# Altium schematic sheet Motor Drive Board Header.SchDoc
size A4; SheetNumber: 3; SheetTotal: 3
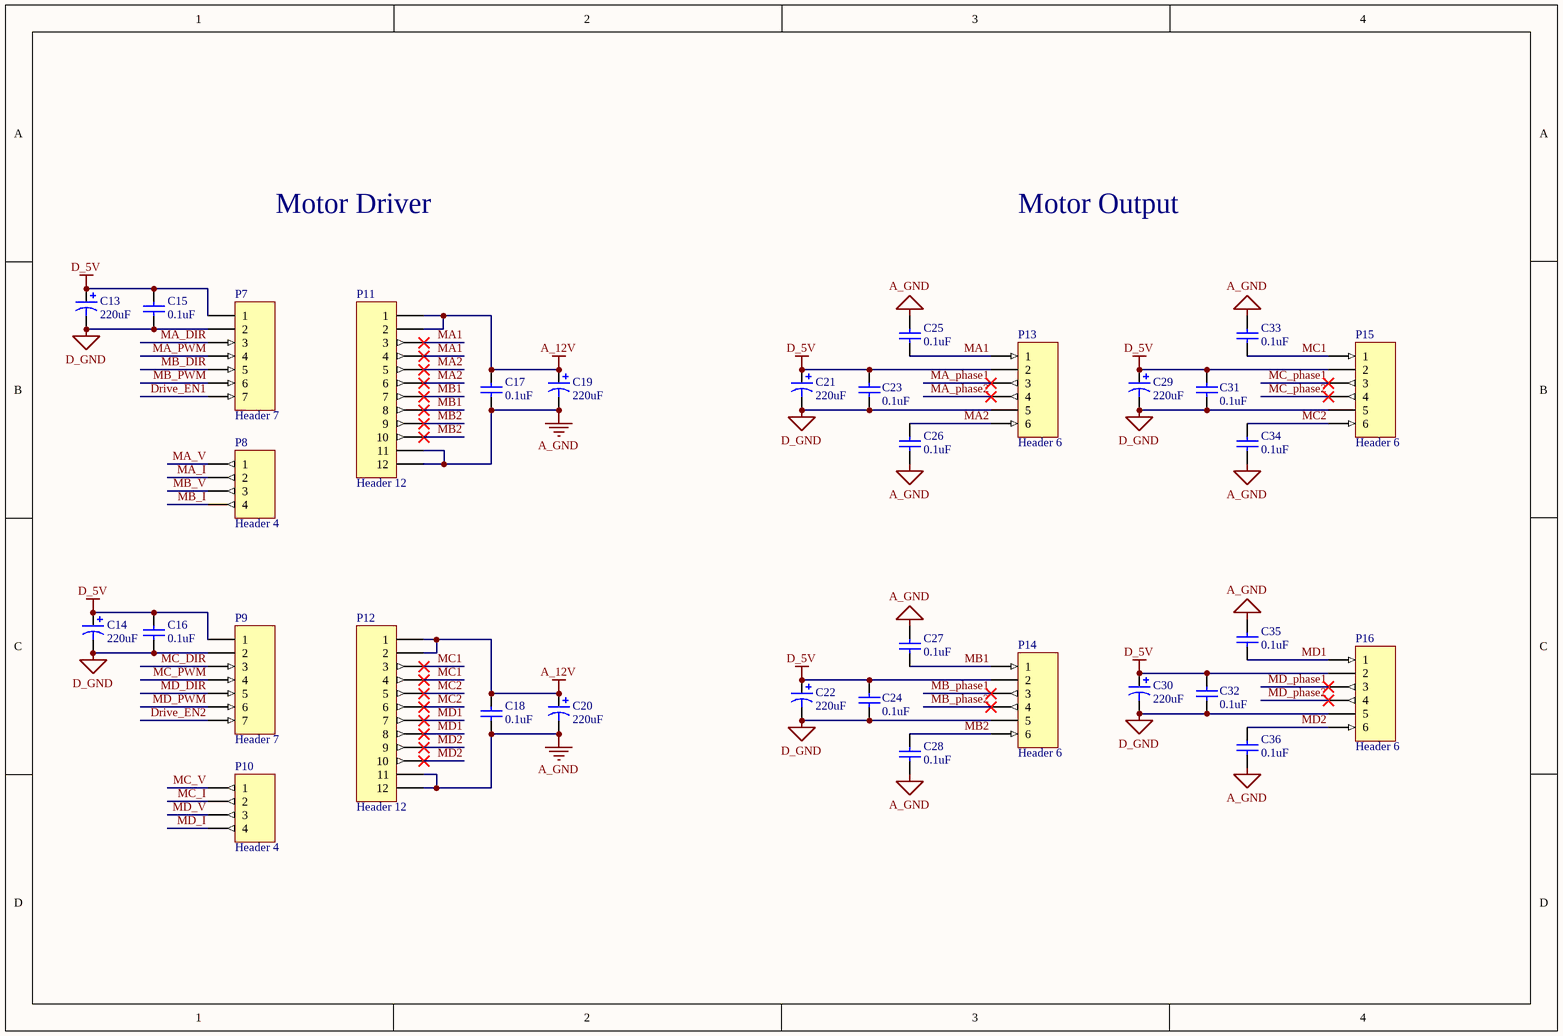
[diagram p0: Motor Drive Board Header.SchDoc]

## Parts
C13  220uF  [VZT221M1ETR-0607]
C14  220uF  [VZT221M1ETR-0607]
C15  0.1uF  [1210B104K500NT]
C16  0.1uF  [1210B104K500NT]
C17  0.1uF  [1210B104K500NT]
C18  0.1uF  [1210B104K500NT]
C19  220uF  [VZT221M1ETR-0607]
C20  220uF  [VZT221M1ETR-0607]
C21  220uF  [VZT221M1ETR-0607]
C22  220uF  [VZT221M1ETR-0607]
C23  0.1uF  [CL10B104KA8NNNC]
C24  0.1uF  [CL10B104KA8NNNC]
C25  0.1uF  [1210B104K500NT]
C26  0.1uF  [1210B104K500NT]
C27  0.1uF  [1210B104K500NT]
C28  0.1uF  [1210B104K500NT]
C29  220uF  [VZT221M1ETR-0607]
C30  220uF  [VZT221M1ETR-0607]
C31  0.1uF  [CL10B104KA8NNNC]
C32  0.1uF  [CL10B104KA8NNNC]
C33  0.1uF  [1210B104K500NT]
C34  0.1uF  [1210B104K500NT]
C35  0.1uF  [1210B104K500NT]
C36  0.1uF  [1210B104K500NT]
P7  Header 7  [KH-2.54FH-1X7P-H8.5]
P8  Header 4  [KH-2.54FH-1X4P-H8.5]
P9  Header 7  [KH-2.54FH-1X7P-H8.5]
P10  Header 4  [KH-2.54FH-1X4P-H8.5]
P11  Header 12  [KH-2.54FH-1X12P-H8.5 (Pad Linked)]
P12  Header 12  [KH-2.54FH-1X12P-H8.5 (Pad Linked)]
P13  Header 6  [B6B-XH-A(LF)(SN)]
P14  Header 6  [B6B-XH-A(LF)(SN)]
P15  Header 6  [B6B-XH-A(LF)(SN)]
P16  Header 6  [B6B-XH-A(LF)(SN)]

## Nets
A_12V: C17.2 C18.2 C19.1 C20.1 P11.1 P11.2 P12.1 P12.2
A_GND: C17.1 C18.1 C19.2 C20.2 C25.2 C26.1 C27.2 C28.1 C33.2 C34.1 C35.2 C36.1 P11.11 P11.12 P12.11 P12.12
D_5V: C13.1 C14.1 C15.2 C16.2 C21.1 C22.1 C23.2 C24.2 C29.1 C30.1 C31.2 C32.2 P7.1 P9.1 P13.2 P14.2 P15.2 P16.2
D_GND: C13.2 C14.2 C15.1 C16.1 C21.2 C22.2 C23.1 C24.1 C29.2 C30.2 C31.1 C32.1 P7.2 P9.2 P13.5 P14.5 P15.5 P16.5
Drive_EN1: P7.7
Drive_EN2: P9.7
MA1: C25.1 P11.3 P11.4 P13.1
MA2: C26.2 P11.5 P11.6 P13.6
MA_DIR: P7.3
MA_I: P8.2
MA_phase1: P13.3
MA_phase2: P13.4
MA_PWM: P7.4
MA_V: P8.1
MB1: C27.1 P11.7 P11.8 P14.1
MB2: C28.2 P11.9 P11.10 P14.6
MB_DIR: P7.5
MB_I: P8.4
MB_phase1: P14.3
MB_phase2: P14.4
MB_PWM: P7.6
MB_V: P8.3
MC1: C33.1 P12.3 P12.4 P15.1
MC2: C34.2 P12.5 P12.6 P15.6
MC_DIR: P9.3
MC_I: P10.2
MC_phase1: P15.3
MC_phase2: P15.4
MC_PWM: P9.4
MC_V: P10.1
MD1: C35.1 P12.7 P12.8 P16.1
MD2: C36.2 P12.9 P12.10 P16.6
MD_DIR: P9.5
MD_I: P10.4
MD_phase1: P16.3
MD_phase2: P16.4
MD_PWM: P9.6
MD_V: P10.3

## Notes on the sheet
- Motor Driver
- Motor Output

## Library data of the parts
C13 C14 C19-C22 C29 C30 = Cap Pol1: -45℃~+105℃ 2000hrs@105℃ 220uF 7.7mm 25V 6.3mm ±20% SMD,6.3x7.7mm  Aluminum Electrolytic Capacitors - SMD ROHS; Published: 8-Jun-2000; LatestRevisionDate: 17-Jul-2002; LatestRevisionNote: Re-released for DXP Platform.; PackageReference: RB7.6-15; Publisher: Altium Limited; PackageDescription: Polarized Capacitor (Radial); 2 Leads
C15-C18 C25-C28 C33-C36 = Cap Semi: 50V 100nF X7R ±10% 1210  Multilayer Ceramic Capacitors MLCC - SMD/SMT ROHS; Published: 8-Jun-2000; LatestRevisionDate: 29-May-2009; LatestRevisionNote: IPC-7351 Footprint Added.; PackageReference: C1206; Publisher: Altium Limited; PackageDescription: Chip Capacitor
C23 C24 C31 C32 = Cap Semi: 25V 100nF X7R ±10% 0603  Multilayer Ceramic Capacitors MLCC - SMD/SMT ROHS; Published: 8-Jun-2000; LatestRevisionDate: 29-May-2009; LatestRevisionNote: IPC-7351 Footprint Added.; PackageReference: C1206; Publisher: Altium Limited; PackageDescription: Chip Capacitor
P7 P9 = Header 7: 3A Straight Square Pins 2.5mm 6mm -40℃~+105℃ 1 7 3mm 2.54mm Black 1x7P Plugin,P=2.54mm  Pin Headers ROHS; LatestRevisionDate: 17-Jul-2002; LatestRevisionNote: Re-released for DXP Platform.; Publisher: Altium Limited
P8 P10 = Header 4: 3A Straight Square Pins 2.5mm 6mm -40℃~+105℃ 1 4 3mm 2.54mm Black 1x4P Plugin,P=2.54mm  Pin Headers ROHS; LatestRevisionDate: 17-Jul-2002; LatestRevisionNote: Re-released for DXP Platform.; Publisher: Altium Limited
P11 P12 = Header 12: 3A Straight Square Pins 2.5mm 6mm -40℃~+105℃ 1 12 3mm 2.54mm Black 1x12P Plugin,P=2.54mm  Pin Headers ROHS; LatestRevisionDate: 17-Jul-2002; LatestRevisionNote: Re-released for DXP Platform.; Publisher: Altium Limited
P13-P16 = Header 6: 1x6P XH 1 2.5mm 6 Brass Plugin,P=2.5mm  Wire To Board / Wire To Wire Connector ROHS; LatestRevisionDate: 17-Jul-2002; LatestRevisionNote: Re-released for DXP Platform.; Publisher: Altium Limited